# Altium schematic sheet DARKYDEN_TOP_LEVEL.SchDoc: DARKYDEN_TOP_LEVEL
size Letter; ApprovedBy: APPROUVÉ PAR; Author: Harold Malbrouck; Organization: Cegep Limoilou; Address1: 1300, 8e Avenue; Address2: Québec, QC; Address3: Canada; Address4: G1J 5L5; Revision: Rev.B; SheetNumber: 1; SheetTotal: 22
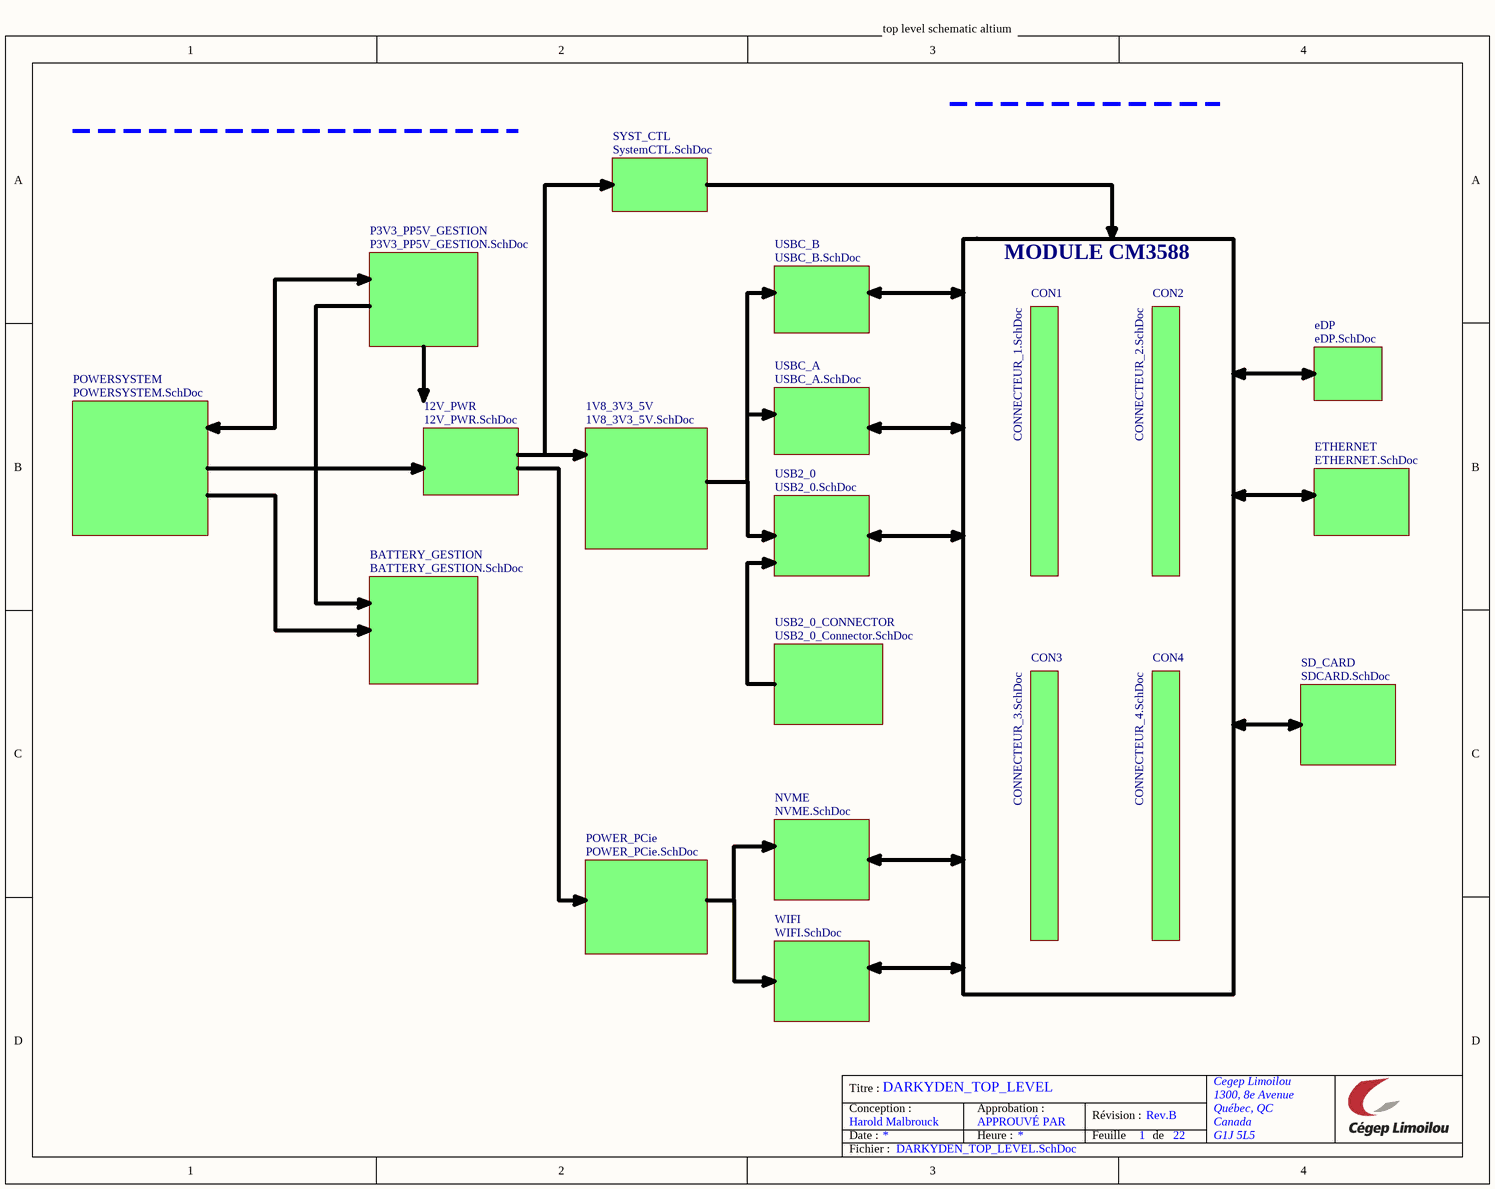
[diagram p0: DARKYDEN_TOP_LEVEL.SchDoc]

## Sub-sheets
1V8_3V3_5V = 1V8_3V3_5V.SchDoc: no entries
12V_PWR = 12V_PWR.SchDoc: no entries
BATTERY_GESTION = BATTERY_GESTION.SchDoc: no entries
CON1 = CONNECTEUR_1.SchDoc: no entries
CON2 = CONNECTEUR_2.SchDoc: no entries
CON3 = CONNECTEUR_3.SchDoc: no entries
CON4 = CONNECTEUR_4.SchDoc: no entries
eDP = eDP.SchDoc: no entries
ETHERNET = ETHERNET.SchDoc: no entries
NVME = NVME.SchDoc: no entries
P3V3_PP5V_GESTION = P3V3_PP5V_GESTION.SchDoc: no entries
POWER_PCie = POWER_PCie.SchDoc: no entries
POWERSYSTEM = POWERSYSTEM.SchDoc: no entries
SD_CARD = SDCARD.SchDoc: no entries
SYST_CTL = SystemCTL.SchDoc: no entries
USB2_0 = USB2_0.SchDoc: no entries
USB2_0_CONNECTOR = USB2_0_Connector.SchDoc: no entries
USBC_A = USBC_A.SchDoc: no entries
USBC_B = USBC_B.SchDoc: no entries
WIFI = WIFI.SchDoc: no entries

## Notes on the sheet
- top level schematic altium
- MODULE CM3588
- Titre :
- Conception :
- Date :
- Approbation :
- Heure :
- Révision :
- Feuille
- de
- Fichier :